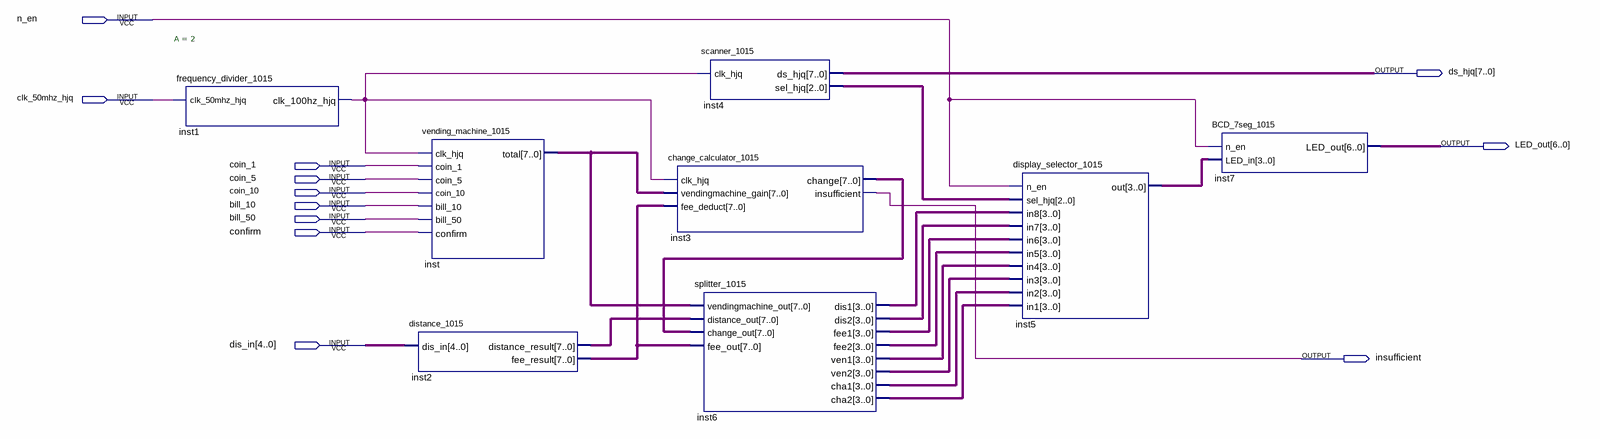
[diagram p0: schematic sheet]
// Quartus schematic top_1015.bdf as structural Verilog: 8 symbols, 12 pins
module top_1015 (
  input  n_en,
  input  clk_50mhz_hjq,
  input  coin_1,
  input  coin_5,
  input  coin_10,
  input  bill_10,
  input  bill_50,
  input  confirm,
  input  [4:0] dis_in,
  output [7:0] ds_hjq,
  output [6:0] LED_out,
  output insufficient
);

  wire inst1_clk_100hz_hjq;
  wire [2:0] inst4_sel_hjq;
  wire [3:0] inst5_out, inst6_cha1, inst6_cha2, inst6_dis1, inst6_dis2, inst6_fee1, inst6_fee2, inst6_ven1,
       inst6_ven2;
  wire [7:0] inst2_distance_result, inst2_fee_result, inst3_change, inst_total;

  frequency_divider_1015 #(.A(2)) inst1 (.clk_50mhz_hjq(clk_50mhz_hjq), .clk_100hz_hjq(inst1_clk_100hz_hjq));
  vending_machine_1015 inst (
    .clk_hjq(inst1_clk_100hz_hjq), .coin_1(coin_1), .coin_5(coin_5), .coin_10(coin_10), .bill_10(bill_10),
    .bill_50(bill_50), .confirm(confirm), .total(inst_total));
  distance_1015 inst2 (.dis_in(dis_in), .distance_result(inst2_distance_result), .fee_result(inst2_fee_result));
  scanner_1015 inst4 (.clk_hjq(inst1_clk_100hz_hjq), .ds_hjq(ds_hjq), .sel_hjq(inst4_sel_hjq));
  change_calculator_1015 inst3 (
    .clk_hjq(inst1_clk_100hz_hjq), .vendingmachine_gain(inst_total), .fee_deduct(inst2_fee_result),
    .change(inst3_change), .insufficient(insufficient));
  splitter_1015 inst6 (
    .vendingmachine_out(inst_total), .distance_out(inst2_distance_result), .change_out(inst3_change),
    .fee_out(inst2_fee_result), .dis1(inst6_dis1), .dis2(inst6_dis2), .fee1(inst6_fee1), .fee2(inst6_fee2),
    .ven1(inst6_ven1), .ven2(inst6_ven2), .cha1(inst6_cha1), .cha2(inst6_cha2));
  display_selector_1015 inst5 (
    .n_en(n_en), .sel_hjq(inst4_sel_hjq), .in8(inst6_dis1), .in7(inst6_dis2), .in6(inst6_fee1),
    .in5(inst6_fee2), .in4(inst6_ven1), .in3(inst6_ven2), .in2(inst6_cha1), .in1(inst6_cha2), .out(inst5_out));
  BCD_7seg_1015 inst7 (.n_en(n_en), .LED_in(inst5_out), .LED_out(LED_out));
endmodule
